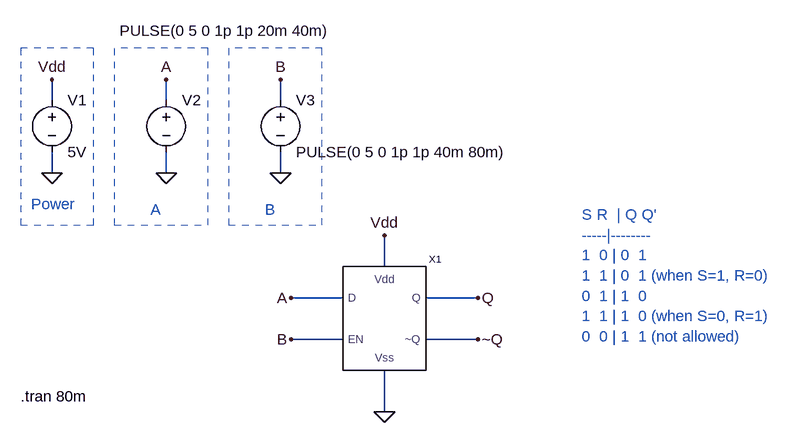
[diagram p0: schematic d_block.asc]
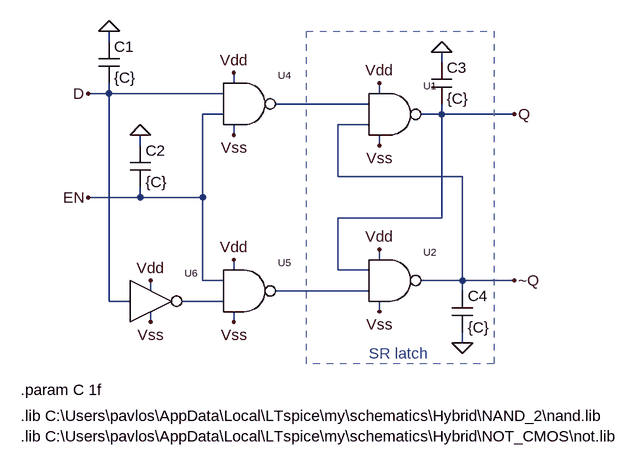
[diagram p1: sub-circuit d.asc]
d_block.asc, the LTspice schematic file:
Version 4
SHEET 1 880 680
WIRE -560 -416 -560 -448
WIRE -384 -416 -384 -448
WIRE -208 -416 -208 -448
WIRE -560 -304 -560 -336
WIRE -384 -304 -384 -336
WIRE -208 -304 -208 -336
WIRE -48 -160 -48 -208
WIRE -112 -112 -192 -112
WIRE 96 -112 16 -112
WIRE -112 -48 -192 -48
WIRE 96 -48 16 -48
WIRE -48 64 -48 0
FLAG 96 -112 Q
FLAG -192 -112 A
FLAG -48 -208 Vdd
FLAG -48 64 0
FLAG -560 -304 0
FLAG -560 -448 Vdd
FLAG -384 -304 0
FLAG -384 -448 A
FLAG -192 -48 B
FLAG -208 -304 0
FLAG -208 -448 B
FLAG 96 -48 ~Q
SYMBOL voltage -560 -432 R0
WINDOW 123 0 0 Left 0
WINDOW 39 0 0 Left 0
SYMATTR InstName V1
SYMATTR Value 5V
SYMBOL voltage -384 -432 R0
WINDOW 123 0 0 Left 0
WINDOW 39 0 0 Left 0
WINDOW 3 -72 -91 Left 2
SYMATTR Value PULSE(0 5 0 1p 1p 20m 40m)
SYMATTR InstName V2
SYMBOL voltage -208 -432 R0
WINDOW 123 0 0 Left 0
WINDOW 39 0 0 Left 0
SYMATTR InstName V3
SYMATTR Value PULSE(0 5 0 1p 1p 40m 80m)
SYMBOL D -112 0 R0
SYMATTR InstName X1
TEXT -592 -256 Left 2 ;Power
TEXT -408 -248 Left 2 ;A
TEXT -608 40 Left 2 !.tran 80m
TEXT -232 -248 Left 2 ;B
TEXT 256 -240 Left 2 ;S R  | Q Q'\n-----|--------\n1  0 | 0  1\n1  1 | 0  1 (when S=1, R=0)\n0  1 | 1  0\n1  1 | 1  0 (when S=0, R=1)\n0  0 | 1  1 (not allowed)
RECTANGLE Normal -496 -496 -608 -224 2
RECTANGLE Normal -320 -496 -464 -224 2
RECTANGLE Normal -144 -496 -288 -224 2

d.asc, the sub-circuit schematic file:
Version 4
SHEET 1 880 680
WIRE -592 -320 -592 -336
WIRE -80 -288 -80 -304
WIRE -400 -256 -400 -272
WIRE -592 -240 -592 -256
WIRE -592 -240 -624 -240
WIRE -416 -240 -592 -240
WIRE -176 -240 -176 -256
WIRE -192 -224 -336 -224
WIRE -416 -208 -448 -208
WIRE -80 -208 -80 -224
WIRE -80 -208 -112 -208
WIRE 32 -208 -80 -208
WIRE -192 -192 -240 -192
WIRE -400 -176 -400 -192
WIRE -544 -160 -544 -176
WIRE -176 -160 -176 -176
WIRE -240 -112 -240 -192
WIRE -48 -112 -240 -112
WIRE -544 -80 -544 -96
WIRE -544 -80 -624 -80
WIRE -448 -80 -448 -208
WIRE -448 -80 -544 -80
WIRE -80 -48 -80 -208
WIRE -80 -48 -240 -48
WIRE -176 16 -176 0
WIRE -400 32 -400 16
WIRE -240 32 -240 -48
WIRE -192 32 -240 32
WIRE -448 48 -448 -80
WIRE -416 48 -448 48
WIRE -48 48 -48 -112
WIRE -48 48 -112 48
WIRE 32 48 -48 48
WIRE -528 64 -528 48
WIRE -192 64 -336 64
WIRE -48 64 -48 48
WIRE -592 80 -592 -240
WIRE -560 80 -592 80
WIRE -416 80 -480 80
WIRE -176 96 -176 80
WIRE -528 112 -528 96
WIRE -400 112 -400 96
WIRE -48 144 -48 128
FLAG -176 -256 Vdd
FLAG -176 0 Vdd
FLAG -176 -160 Vss
FLAG -176 96 Vss
FLAG -624 -240 D
FLAG -624 -80 EN
FLAG 32 -208 Q
FLAG 32 48 ~Q
FLAG -400 -272 Vdd
FLAG -400 -176 Vss
FLAG -400 16 Vdd
FLAG -400 112 Vss
FLAG -528 48 Vdd
FLAG -528 112 Vss
FLAG -544 -176 0
FLAG -592 -336 0
FLAG -80 -304 0
FLAG -48 144 0
SYMBOL nand -192 -176 R0
SYMATTR InstName U1
SYMBOL nand -192 80 R0
SYMATTR InstName U2
SYMBOL nand -416 -192 R0
SYMATTR InstName U4
SYMBOL nand -416 96 R0
SYMATTR InstName U5
SYMBOL not -560 112 R0
SYMATTR InstName U6
SYMBOL cap -608 -320 R0
SYMATTR InstName C1
SYMATTR Value {C}
SYMBOL cap -560 -160 R0
SYMATTR InstName C2
SYMATTR Value {C}
SYMBOL cap -96 -288 R0
SYMATTR InstName C3
SYMATTR Value {C}
SYMBOL cap -64 64 R0
SYMATTR InstName C4
SYMATTR Value {C}
TEXT -728 256 Left 2 !.lib C:\\Users\\pavlos\\AppData\\Local\\LTspice\\my\\schematics\\Hybrid\\NAND_2\\nand.lib
TEXT -192 160 Left 2 ;SR latch
TEXT -728 288 Left 2 !.lib C:\\Users\\pavlos\\AppData\\Local\\LTspice\\my\\schematics\\Hybrid\\NOT_CMOS\\not.lib
TEXT -728 216 Left 2 !.param C 1f
RECTANGLE Normal 0 176 -288 -336 2

The netlist it stands for:
* d_block.asc
V1 Vdd 0 5V
V2 A 0 PULSE(0 5 0 1p 1p 20m 40m)
V3 B 0 PULSE(0 5 0 1p 1p 40m 80m)
XX1 A B Q ~Q Vdd 0 d

* block symbol definitions
.subckt d D EN Q ~Q Vdd Vss
XU1 N001 ~Q Q Vdd Vss nand  ; pins A B Y Vdd Vss
XU2 Q N002 ~Q Vdd Vss nand  ; pins A B Y Vdd Vss
XU4 D EN N001 Vdd Vss nand  ; pins A B Y Vdd Vss
XU5 EN N003 N002 Vdd Vss nand  ; pins A B Y Vdd Vss
XU6 D N003 Vdd Vss not  ; pins A Y Vdd Vss
C1 0 D {C}
C2 0 EN {C}
C3 0 Q {C}
C4 ~Q 0 {C}
.lib C:\Users\pavlos\AppData\Local\LTspice\my\schematics\Hybrid\NAND_2\nand.lib
* SR latch
.lib C:\Users\pavlos\AppData\Local\LTspice\my\schematics\Hybrid\NOT_CMOS\not.lib
.param C 1f
.ends d

* Power
* A
.tran 80m
* B
* S R  | Q Q'
* -----|--------
* 1  0 | 0  1
* 1  1 | 0  1 (when S=1, R=0)
* 0  1 | 1  0
* 1  1 | 1  0 (when S=0, R=1)
* 0  0 | 1  1 (not allowed)
.backanno
.end